# Altium schematic sheet Sheet1.SchDoc
size A0
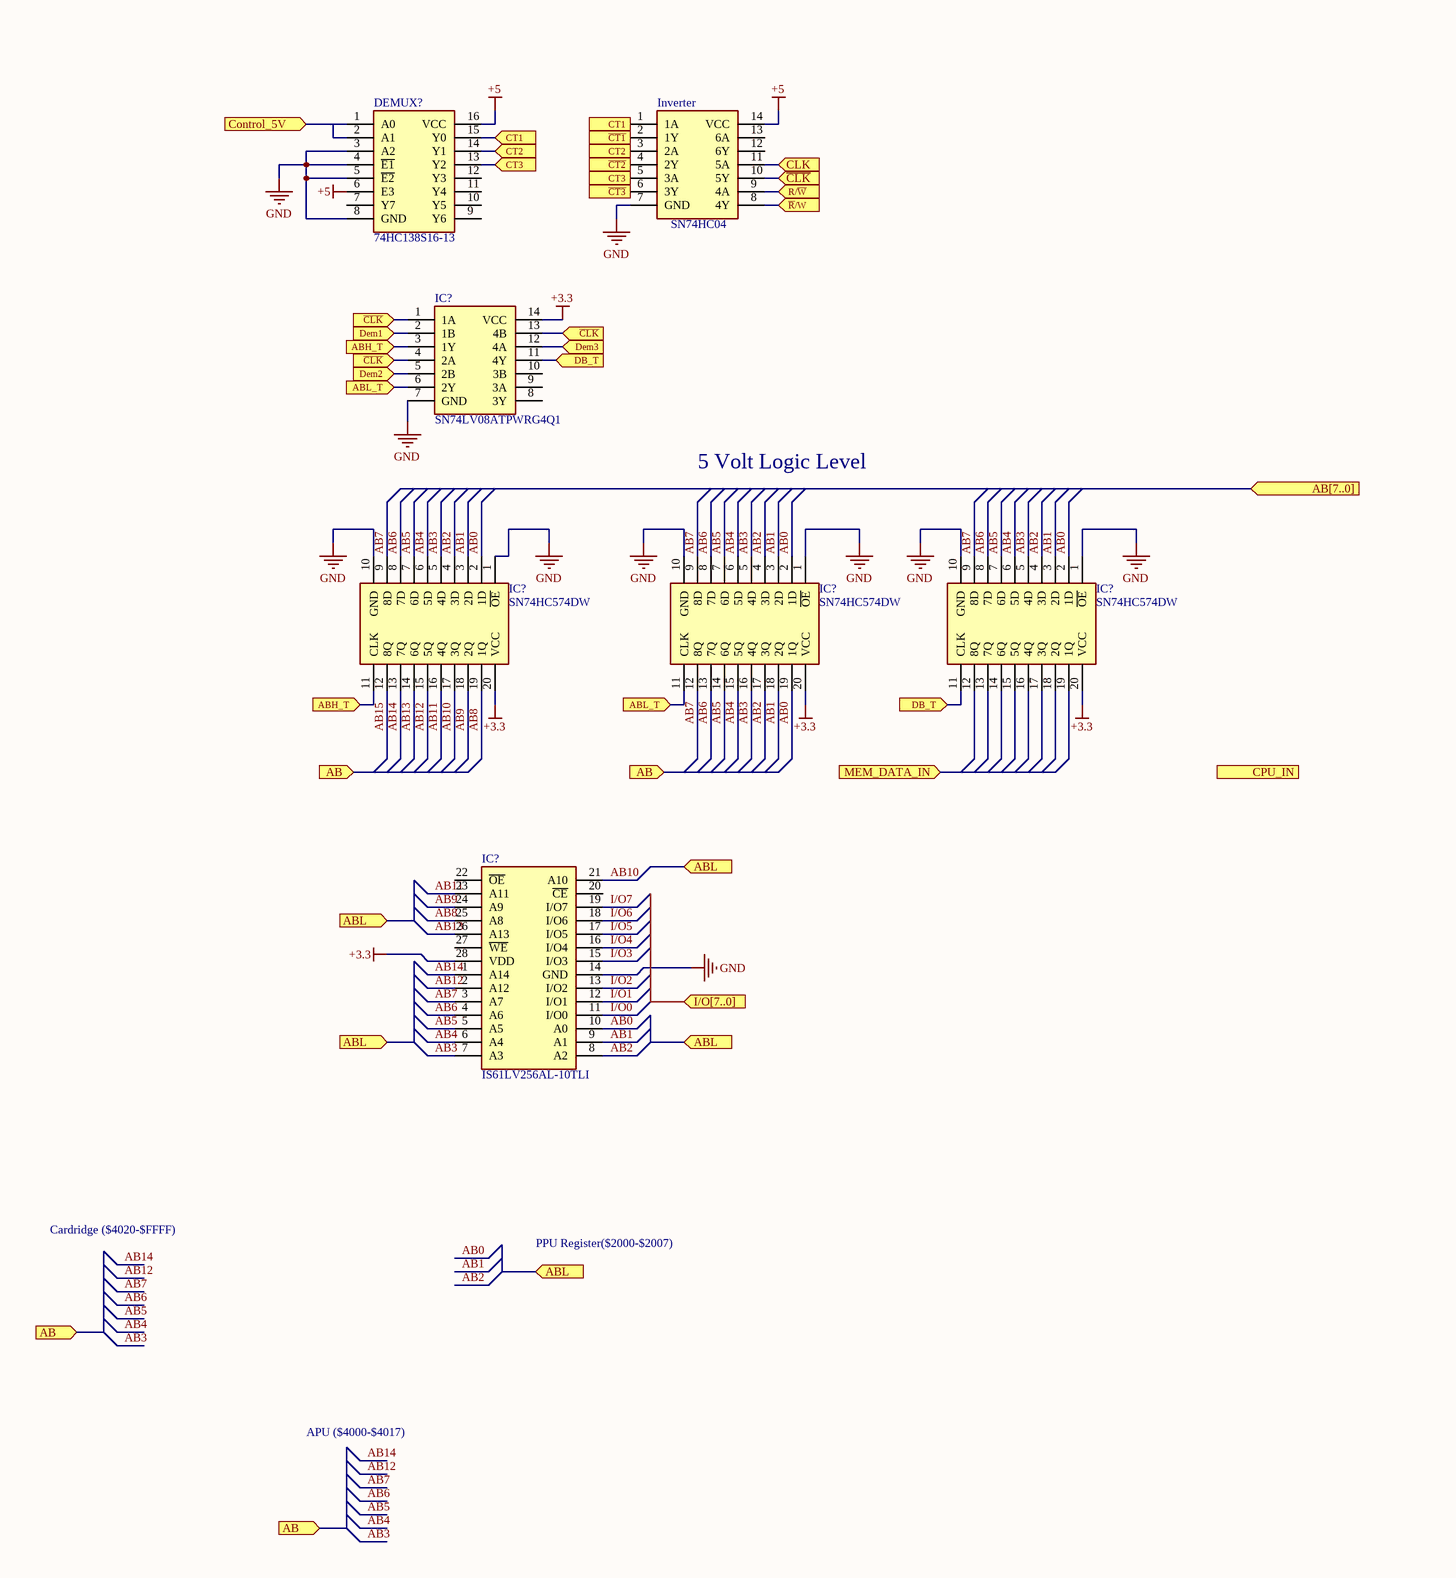
[diagram p0: Sheet1.SchDoc, left]
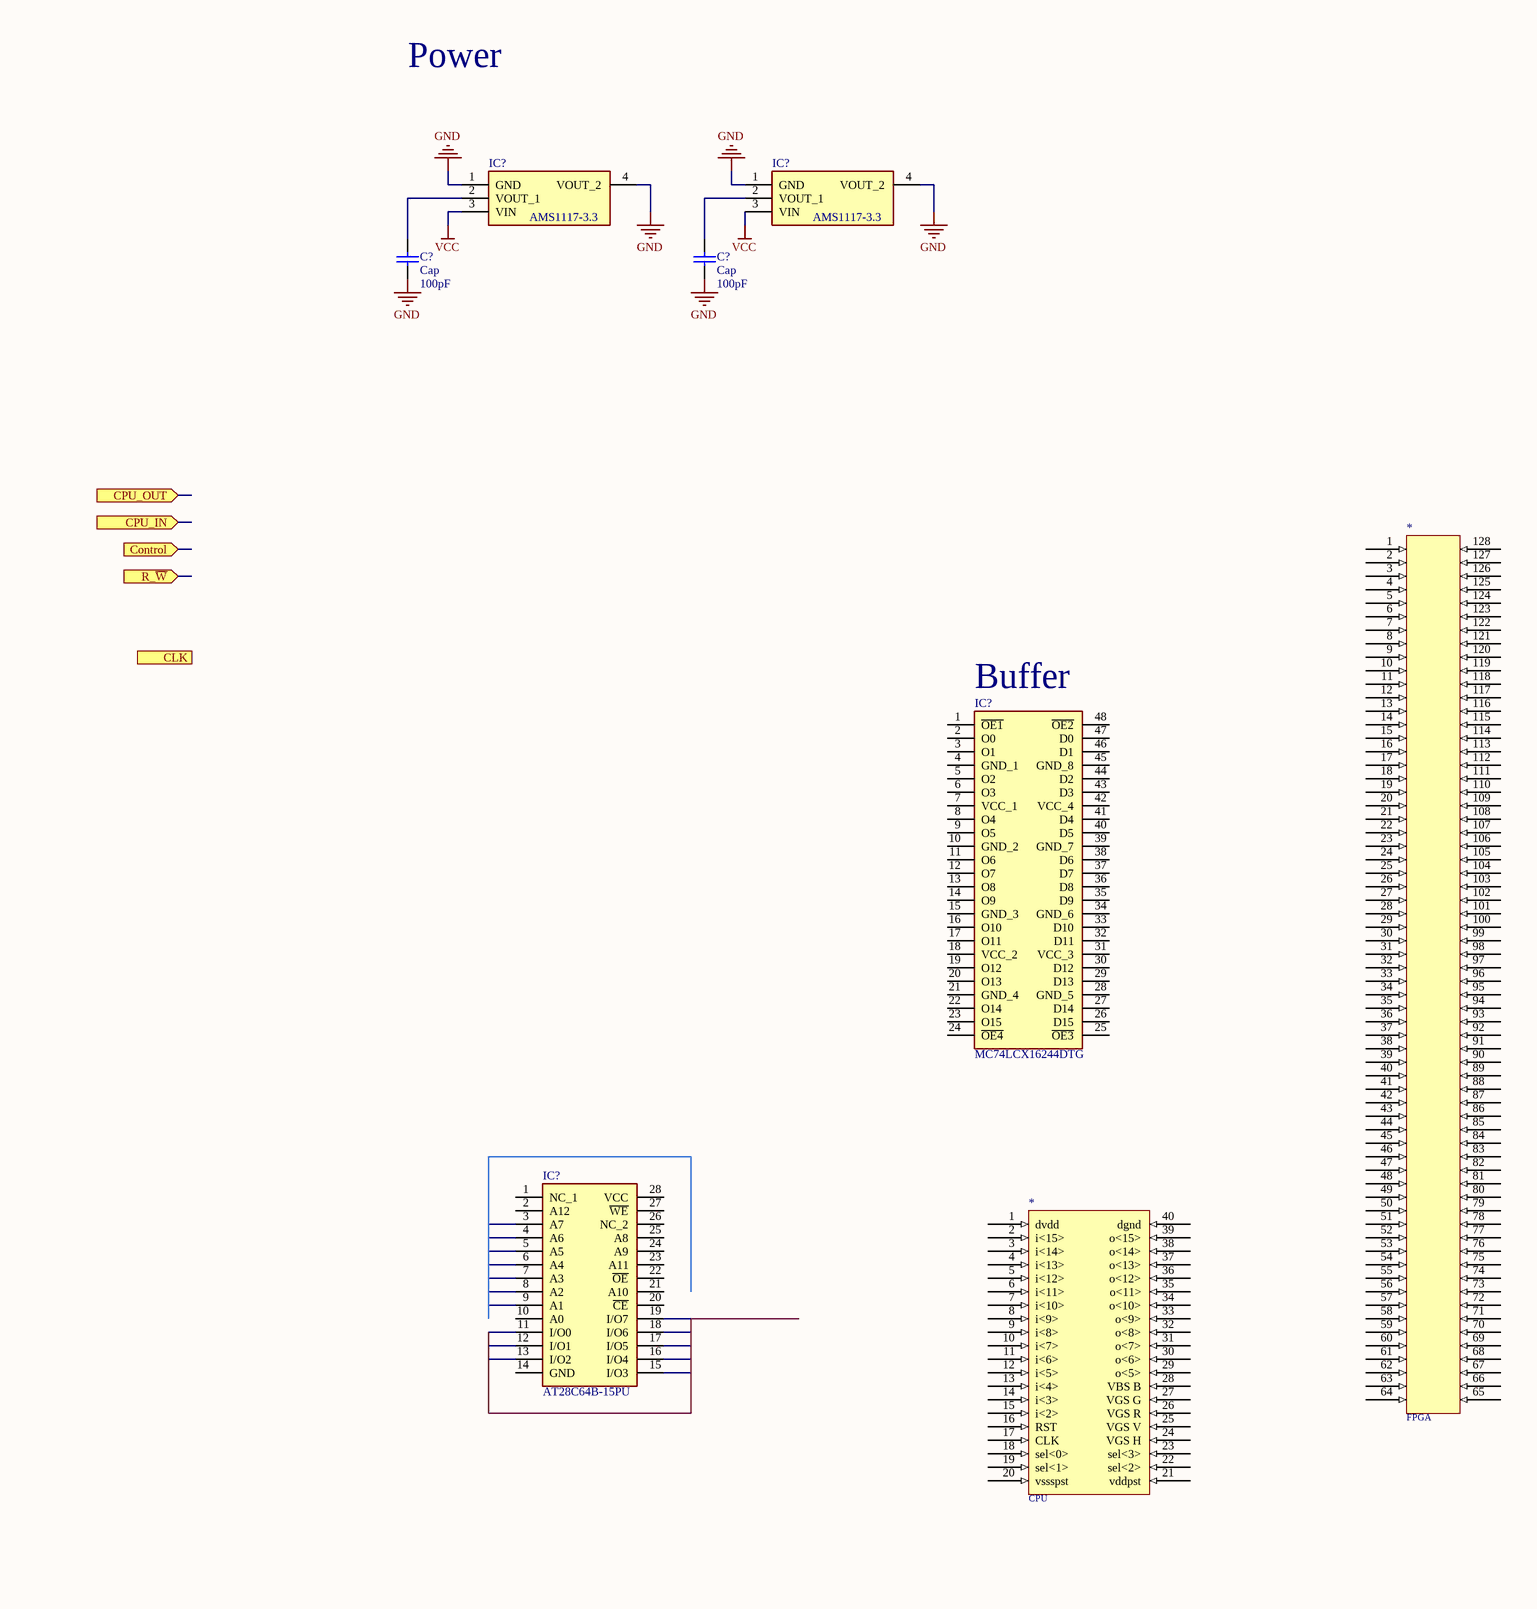
[diagram p1: Sheet1.SchDoc, right]

## Parts
(Parts that share a designator on the sheet are numbered #1, #2 ... from top to bottom, then left to right.)
*#1  FPGA  [Cyclone_IV_EP4CE15]
*#2  CPU  [Processor]
C?#1  Cap  value 100pF  [RAD-0.3]
C?#2  Cap  value 100pF  [RAD-0.3]
DEMUX?  74HC138S16-13  [SOIC127P600X175-16N]
IC?#1  AMS1117-3.3  [SOT229P700X180-4N]
IC?#2  AMS1117-3.3  [SOT229P700X180-4N]
IC?#3  MC74LCX16244DTG  [SOP50P810X110-48N]
IC?#4  SN74LV08ATPWRG4Q1  [SOP65P640X120-14N]
IC?#5  SN74HC574DW  [SOIC127P1030X265-20N]
IC?#6  SN74HC574DW  [SOIC127P1030X265-20N]
IC?#7  SN74HC574DW  [SOIC127P1030X265-20N]
IC?#8  AT28C64B-15PU  [DIP1556W56P254L3702H483Q28N]
IC?#9  IS61LV256AL-10TLI  [IS61LV256AL10TLI]
Inverter  SN74HC04  [SOIC127P600X175-14N]

## Ports
AB (in), AB[7..0] (in), ABH_T (in), ABL (in), ABL_T (in), CLK (in), Control (in), Control_5V (in), CPU_IN (in), CPU_OUT (in), CT1 (in), CT2 (in), CT3 (in), DB_T (in), Dem1 (in), Dem2 (in), Dem3 (in), I/O[7..0] (in), MEM_DATA_IN (in), R/~{W} (in), R_~{W} (in), ~{CLK} (in), ~{CT1} (in), ~{CT2} (in), ~{CT3} (in), ~{R}/W (in)

## Nets
+3.3: IC?#4.14(VCC) IC?#5.20(VCC) IC?#6.20(VCC) IC?#7.20(VCC) IC?#9.28(VDD)
+5: DEMUX?.6(E3) DEMUX?.16(VCC) Inverter.14(VCC)
GND: C?#1.1 C?#2.1 DEMUX?.3(A2) DEMUX?.4(~{E1}) DEMUX?.5(~{E2}) DEMUX?.8(GND) IC?#1.1(GND) IC?#1.4(VOUT_2) IC?#2.1(GND) IC?#2.4(VOUT_2) IC?#4.7(GND) IC?#5.1(~{OE}) IC?#5.10(GND) IC?#6.1(~{OE}) IC?#6.10(GND) IC?#7.1(~{OE}) IC?#7.10(GND) IC?#9.14(GND) Inverter.7(GND)
VCC: IC?#1.3(VIN) IC?#2.3(VIN)
~{CT1}: Inverter.2(1Y) ; port ~{CT1}
~{CT2}: Inverter.4(2Y) ; port ~{CT2}
~{CT3}: Inverter.6(3Y) ; port ~{CT3}
AB0: IC?#5.2(1D) IC?#6.2(1D) IC?#6.19(1Q) IC?#7.2(1D) IC?#9.10(A0)
AB1: IC?#5.3(2D) IC?#6.3(2D) IC?#6.18(2Q) IC?#7.3(2D) IC?#9.9(A1)
AB2: IC?#5.4(3D) IC?#6.4(3D) IC?#6.17(3Q) IC?#7.4(3D) IC?#9.8(A2)
AB3: IC?#5.5(4D) IC?#6.5(4D) IC?#6.16(4Q) IC?#7.5(4D) IC?#9.7(A3)
AB4: IC?#5.6(5D) IC?#6.6(5D) IC?#6.15(5Q) IC?#7.6(5D) IC?#9.6(A4)
AB5: IC?#5.7(6D) IC?#6.7(6D) IC?#6.14(6Q) IC?#7.7(6D) IC?#9.5(A5)
AB6: IC?#5.8(7D) IC?#6.8(7D) IC?#6.13(7Q) IC?#7.8(7D) IC?#9.4(A6)
AB7: IC?#5.9(8D) IC?#6.9(8D) IC?#6.12(8Q) IC?#7.9(8D) IC?#9.3(A7)
AB8: IC?#5.19(1Q) IC?#9.25(A8)
AB9: IC?#5.18(2Q) IC?#9.24(A9)
AB10: IC?#5.17(3Q) IC?#9.21(A10)
AB11: IC?#5.16(4Q) IC?#9.23(A11)
AB12: IC?#5.15(5Q) IC?#9.2(A12)
AB13: IC?#5.14(6Q) IC?#9.26(A13)
AB14: IC?#5.13(7Q) IC?#9.1(A14)
AB15: IC?#5.12(8Q)
ABH_T: IC?#4.3(1Y) IC?#5.11(CLK) ; port ABH_T
ABL_T: IC?#4.6(2Y) IC?#6.11(CLK) ; port ABL_T
~{CLK}: IC?#4.1(1A) IC?#4.4(2A) IC?#4.13(4B) Inverter.10(5Y) ; port ~{CLK}
CLK: Inverter.11(5A) ; port CLK
CT1: DEMUX?.15(Y0) Inverter.1(1A) ; port CT1
CT2: DEMUX?.14(Y1) Inverter.3(2A) ; port CT2
CT3: DEMUX?.13(Y2) Inverter.5(3A) ; port CT3
DB_T: IC?#4.11(4Y) IC?#7.11(CLK) ; port DB_T
Dem1: IC?#4.2(1B) ; port Dem1
Dem2: IC?#4.5(2B) ; port Dem2
Dem3: IC?#4.12(4A) ; port Dem3
I/O0: IC?#9.11(I/O0)
I/O1: IC?#9.12(I/O1)
I/O2: IC?#9.13(I/O2)
I/O3: IC?#9.15(I/O3)
I/O4: IC?#9.16(I/O4)
I/O5: IC?#9.17(I/O5)
I/O6: IC?#9.18(I/O6)
I/O7: IC?#9.19(I/O7)
R/~{W}: Inverter.9(4A) ; port R/~{W}
~{R}/W: Inverter.8(4Y) ; port ~{R}/W
NetC?#1_2: C?#1.2 IC?#1.2(VOUT_1)
NetC?#2_2: C?#2.2 IC?#2.2(VOUT_1)

Not connected (* = marked no-connect by the designer): *#1 1 2 3 4 5 6 7 8 9 10 11 12 13 14 15 16 17 18 19 20 21 22 23 24 25 26 27 28 29 30 31 32 33 34 35 36 37 38 39 40 41 42 43 44 45 46 47 48 49 50 51 52 53 54 55 56 57 58 59 60 61 62 63 64 65 66 67 68 69 70 71 72 73 74 75 76 77 78 79 80 81 82 83 84 85 86 87 88 89 90 91 92 93 94 95 96 97 98 99 100 101 102 103 104 105 106 107 108 109 110 111 112 113 114 115 116 117 118 119 120 121 122 123 124 125 126 127 128; *#2 1(dvdd) 2(i<15>) 3(i<14>) 4(i<13>) 5(i<12>) 6(i<11>) 7(i<10>) 8(i<9>) 9(i<8>) 10(i<7>) 11(i<6>) 12(i<5>) 13(i<4>) 14(i<3>) 15(i<2>) 16(RST) 17(CLK) 18(sel<0>) 19(sel<1>) 20(vssspst) 21(vddpst) 22(sel<2>) 23(sel<3>) 24(VGS_H) 25(VGS_V) 26(VGS_R) 27(VGS_G) 28(VBS_B) 29(o<5>) 30(o<6>) 31(o<7>) 32(o<8>) 33(o<9>) 34(o<10>) 35(o<11>) 36(o<12>) 37(o<13>) 38(o<14>) 39(o<15>) 40(dgnd); DEMUX? 1(A0) 2(A1) 7(Y7) 9(Y6) 10(Y5) 11(Y4) 12(Y3); IC?#3 1(~{OE1}) 2(O0) 3(O1) 4(GND_1) 5(O2) 6(O3) 7(VCC_1) 8(O4) 9(O5) 10(GND_2) 11(O6) 12(O7) 13(O8) 14(O9) 15(GND_3) 16(O10) 17(O11) 18(VCC_2) 19(O12) 20(O13) 21(GND_4) 22(O14) 23(O15) 24(~{OE4}) 25(~{OE3}) 26(D15) 27(D14) 28(GND_5) 29(D13) 30(D12) 31(VCC_3) 32(D11) 33(D10) 34(GND_6) 35(D9) 36(D8) 37(D7) 38(D6) 39(GND_7) 40(D5) 41(D4) 42(VCC_4) 43(D3) 44(D2) 45(GND_8) 46(D1) 47(D0) 48(~{OE2}); IC?#4 8(3Y) 9(3A) 10(3B); IC?#7 12(8Q) 13(7Q) 14(6Q) 15(5Q) 16(4Q) 17(3Q) 18(2Q) 19(1Q); IC?#8 1(NC_1) 2(A12) 3(A7) 4(A6) 5(A5) 6(A4) 7(A3) 8(A2) 9(A1) 10(A0) 11(I/O0) 12(I/O1) 13(I/O2) 14(GND) 15(I/O3) 16(I/O4) 17(I/O5) 18(I/O6) 19(I/O7) 20(~{CE}) 21(A10) 22(~{OE}) 23(A11) 24(A9) 25(A8) 26(NC_2) 27(~{WE}) 28(VCC); IC?#9 20(~{CE}) 22(~{OE}) 27(~{WE}); Inverter 12(6Y) 13(6A)

## Notes on the sheet
- Power
- (near IC?#3) Buffer
- 5 Volt Logic Level
- Cardridge ($4020-$FFFF)
- PPU Register($2000-$2007)
- APU ($4000-$4017)
- Title
- Size:
- Date:
- File:
- A0
- Number:
- Time:
- Revision:
- Sheet
- of

## Library data of the parts
C?#1 C?#2 = Cap: Capacitor; Published: 8-Jun-2000; LatestRevisionDate: 17-Jul-2002; LatestRevisionNote: Re-released for DXP Platform.; PackageReference: RAD-0.3; Publisher: Altium Limited; PackageDescription: Radial Cap, Thru-Hole; 2 Leads; 0.3 in Pin Spacing
DEMUX? = 74HC138S16-13: Integrated Circuit; Manufacturer_Name: Diodes Inc.; Datasheet Link: https://www.diodes.com/assets/Datasheets/74HC138.pdf; Height: 1.75mm; Manufacturer_Part_Number: 74HC138S16-13; Mouser Part Number: 621-74HC138S16-13; Mouser Price/Stock: https://www.mouser.com/Search/Refine.aspx?Keyword=621-74HC138S16-13; Arrow Part Number: 74HC138S16-13; Arrow Price/Stock: https://www.arrow.com/en/products/74hc138s16-13/diodes-incorporated
IC?#1 IC?#2 = AMS1117-3.3: Integrated Circuit; Manufacturer_Name: Advanced Monolithic Systems; Datasheet Link: http://www.advanced-monolithic.com/pdf/ds1117.pdf; Height: 1.8mm; Manufacturer_Part_Number: AMS1117-3.3
IC?#3 = MC74LCX16244DTG: Integrated Circuit; Manufacturer_Name: ON Semiconductor; Datasheet Link: http://www.onsemi.com/pub/Collateral/MC74LCX16244-D.PDF; Height: 1.1mm; Manufacturer_Part_Number: MC74LCX16244DTG; Mouser Part Number: 863-MC74LCX16244DTG; Mouser Price/Stock: https://www.mouser.com/Search/Refine.aspx?Keyword=863-MC74LCX16244DTG; Arrow Part Number: MC74LCX16244DTG; Arrow Price/Stock: https://www.arrow.com/en/products/mc74lcx16244dtg/on-semiconductor
IC?#4 = SN74LV08ATPWRG4Q1: Integrated Circuit; Manufacturer_Name: Texas Instruments; Datasheet Link: http://www.ti.com/lit/gpn/sn74lv08a-q1; Height: 1.2mm; Manufacturer_Part_Number: SN74LV08ATPWRG4Q1; Mouser Part Number: 595-N74LV08ATPWRG4Q1; Mouser Price/Stock: https://www.mouser.co.uk/ProductDetail/Texas-Instruments/SN74LV08ATPWRG4Q1?qs=6kmNHVaEmPjTMqWga%2F%252BS6w%3D%3D; Arrow Part Number: SN74LV08ATPWRG4Q1; Arrow Price/Stock: https://www.arrow.com/en/products/sn74lv08atpwrg4q1/texas-instruments
IC?#5-IC?#7 = SN74HC574DW: Integrated Circuit; Manufacturer_Name: Texas Instruments; Datasheet Link: http://www.ti.com/lit/gpn/sn74hc574; Height: 2.65mm; Manufacturer_Part_Number: SN74HC574DW; Mouser Part Number: 595-SN74HC574DW; Mouser Price/Stock: https://www.mouser.co.uk/ProductDetail/Texas-Instruments/SN74HC574DW/?qs=Tv815z3GeNTmteRPNuq6hQ%3D%3D; Arrow Part Number: SN74HC574DW; Arrow Price/Stock: https://www.arrow.com/en/products/sn74hc574dw/texas-instruments
IC?#8 = AT28C64B-15PU: Integrated Circuit; Manufacturer_Name: Microchip; Datasheet Link: http://www.atmel.com/images/doc0270.pdf; Height: 4.826mm; Manufacturer_Part_Number: AT28C64B-15PU; Mouser Part Number: 556-AT28C64B15PU; Mouser Price/Stock: https://www.mouser.co.uk/ProductDetail/Microchip-Technology-Atmel/AT28C64B-15PU/?qs=2VKgqYuc3OvipbcAuBcLow%3D%3D; Arrow Part Number: AT28C64B-15PU; Arrow Price/Stock: https://www.arrow.com/en/products/at28c64b-15pu/microchip-technology
IC?#9 = IS61LV256AL-10TLI: Integrated Circuit; Manufacturer_Name: ISSI; Datasheet Link: http://www.issi.com/WW/pdf/61LV256AL.pdf; Height: 1.2mm; Manufacturer_Part_Number: IS61LV256AL-10TLI
Inverter = SN74HC04D: Integrated Circuit; Manufacturer_Name: Texas Instruments; Datasheet Link: http://www.ti.com/lit/ds/symlink/sn74hc04.pdf?HQS=TI-null-null-digikeymode-df-pf-null-wwe&ts=1590985263778; Height: 1.75mm; Manufacturer_Part_Number: SN74HC04D; Mouser Part Number: 595-SN74HC04D; Mouser Price/Stock: https://www.mouser.co.uk/ProductDetail/Texas-Instruments/SN74HC04D/?qs=L5CvrNUdZiq5DddJvhoqZw%3D%3D; Arrow Part Number: SN74HC04D; Arrow Price/Stock: https://www.arrow.com/en/products/sn74hc04d/texas-instruments